# EAGLE design MDeckBA (EAGLE 9.0.1)

## Sheet 1 of 2
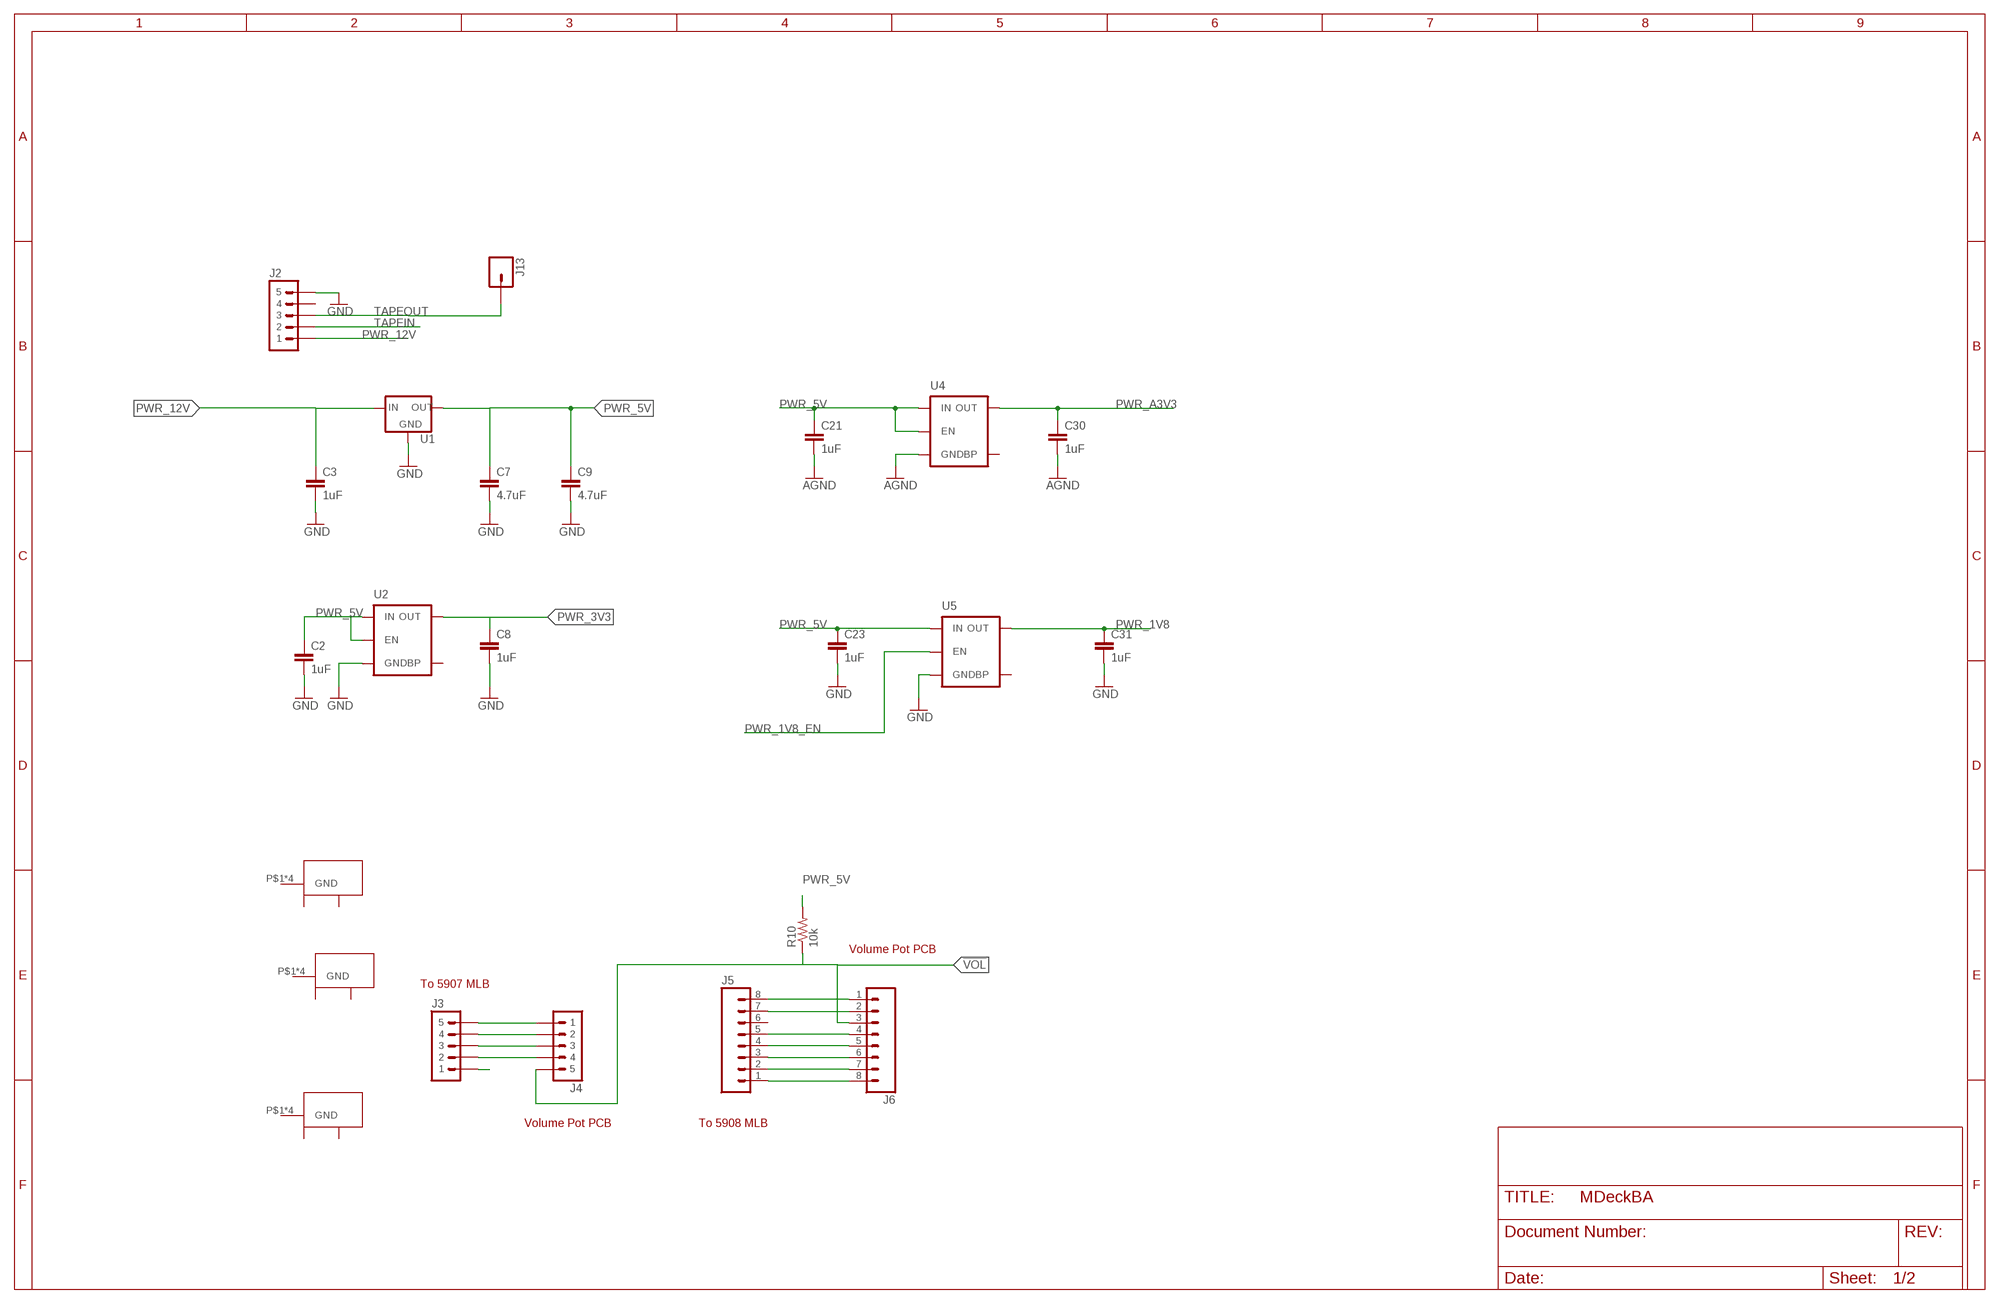
[diagram p0: schematic, sheet 1, part 1 of 3]
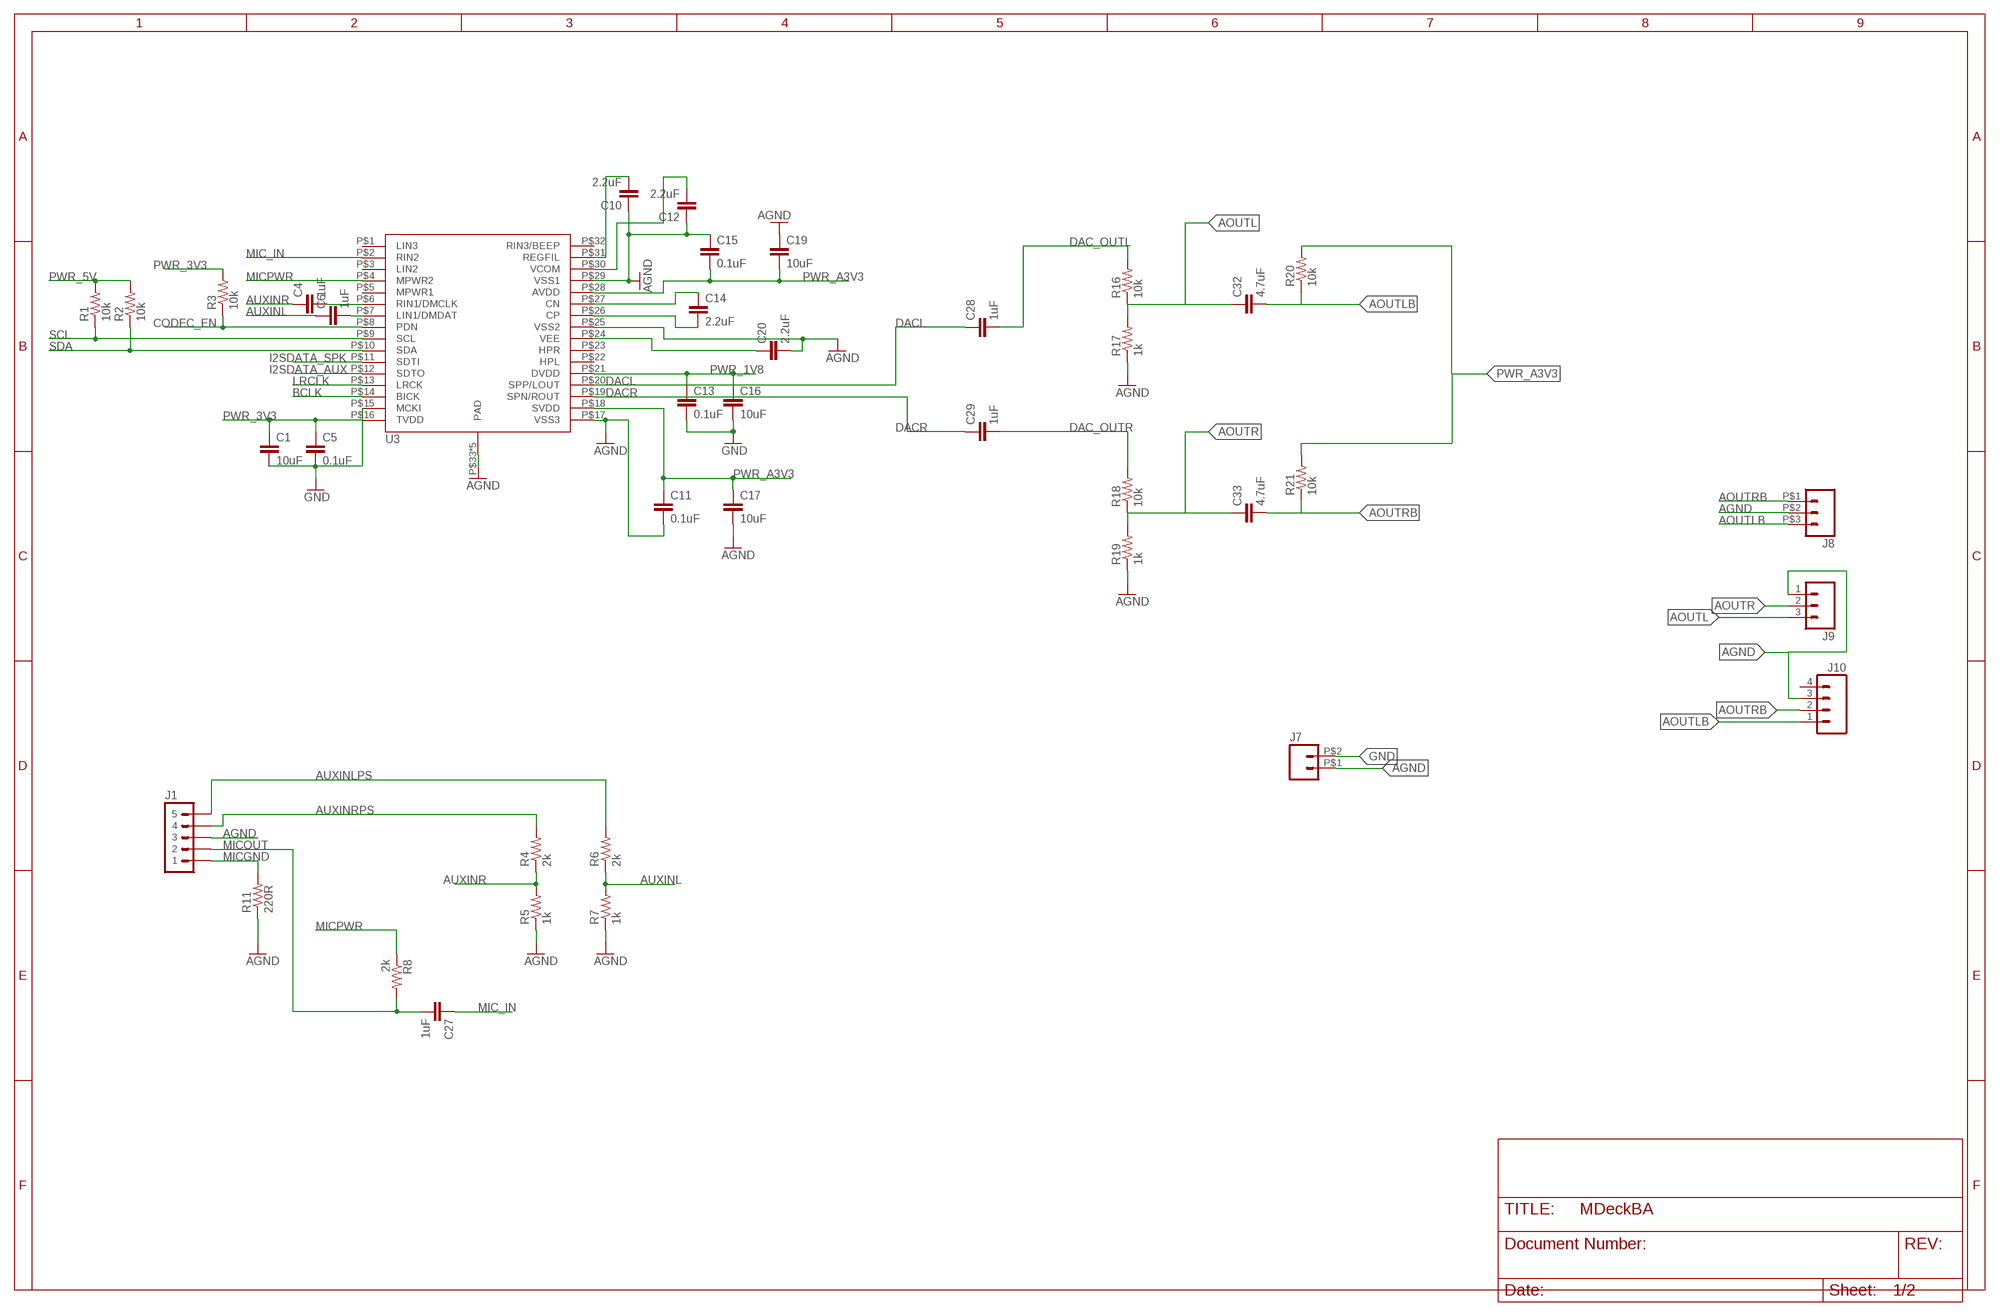
[diagram p1: schematic, sheet 1, part 2 of 3]
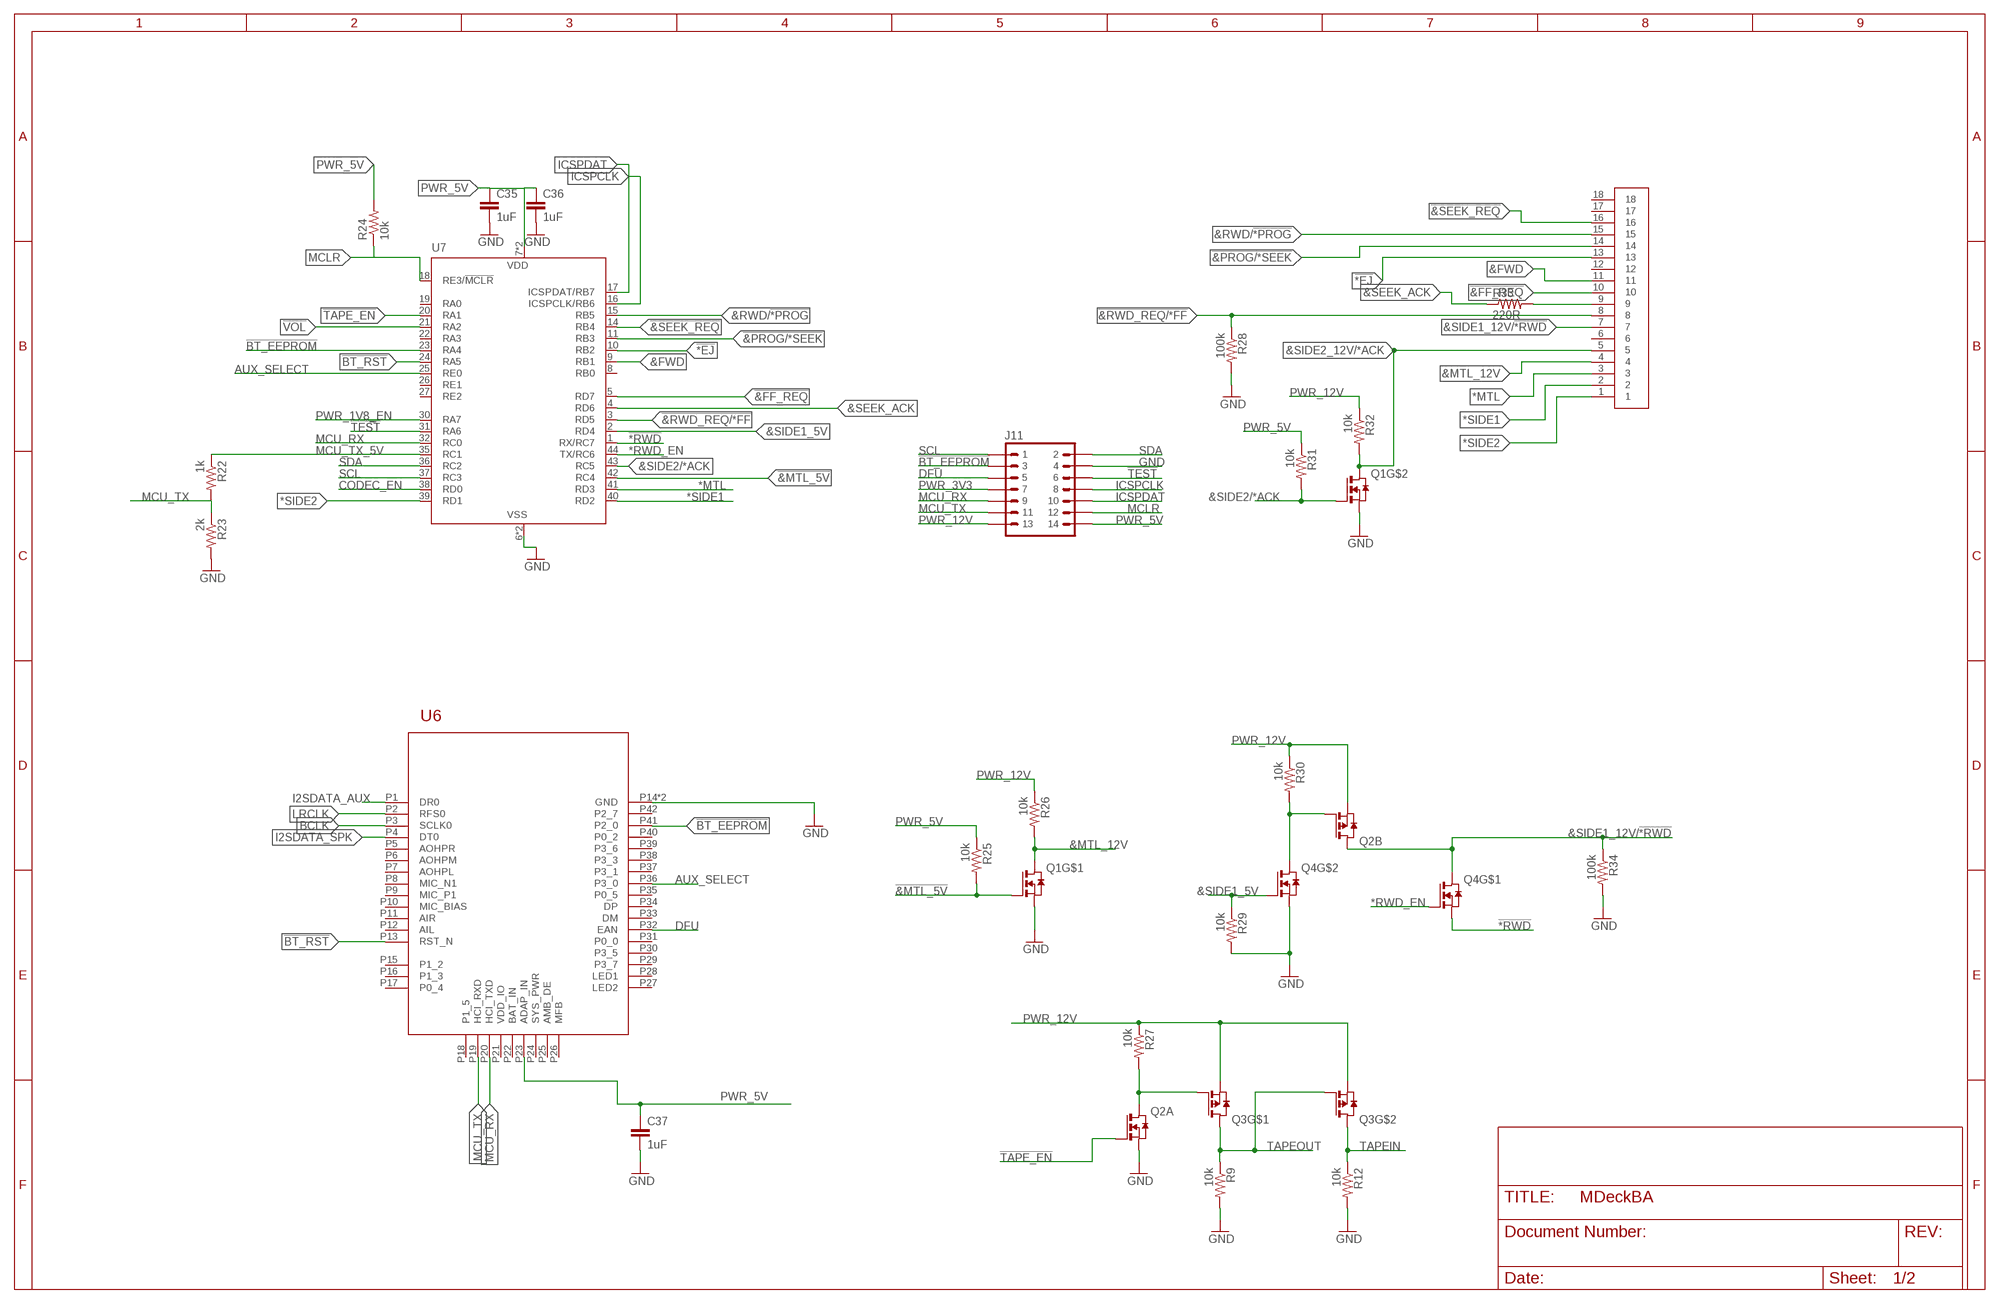
[diagram p2: schematic, sheet 1, part 3 of 3]

### Parts
C1  10uF  CAP0805  [0805]
C2  1uF  CAP0805  [0805]
C3  1uF  CAP0805  [0805]
C4  1uF  CAP0805  [0805]
C5  0.1uF  CAP0805  [0805]
C6  1uF  CAP0805  [0805]
C7  4.7uF  CAP0805  [0805]
C8  1uF  CAP0805  [0805]
C9  4.7uF  CAP0805  [0805]
C10  2.2uF  CAP0805  [0805]
C11  0.1uF  CAP0805  [0805]
C12  2.2uF  CAP0805  [0805]
C13  0.1uF  CAP0805  [0805]
C14  2.2uF  CAP0805  [0805]
C15  0.1uF  CAP0805  [0805]
C16  10uF  CAP0805  [0805]
C17  10uF  CAP0805  [0805]
C19  10uF  CAP0805  [0805]
C20  2.2uF  CAP0805  [0805]
C21  1uF  CAP0805  [0805]
C23  1uF  CAP0805  [0805]
C27  1uF  CAP0805  [0805]
C28  1uF  CAP0805  [0805]
C29  1uF  CAP0805  [0805]
C30  1uF  CAP0805  [0805]
C31  1uF  CAP0805  [0805]
C32  4.7uF  CAP0805  [0805]
C33  4.7uF  CAP0805  [0805]
C35  1uF  CAP0805  [0805]
C36  1uF  CAP0805  [0805]
C37  1uF  CAP0805  [0805]
J1  M05JST  [JST-5-PTH]
J2  M05JST-VERT  [JST-5-PTH-VERT]
J3  M05JST  [JST-5-PTH]
J4  M05JST-VERT  [JST-5-PTH-VERT]
J5  JST-PH-8  [JST-8-PTH]
J6  JST-PH-8-VERT  [JST-8-PTH-VERT]
J7  M022MM_PADS  [1X02_2MM_PADS]
J8  M032MM_PADS  [1X03_2MM_PADS]
J9  M03JST-PTH-VERT  [JST-3-PTH-VERT]
J10  M04JST-PTH-VERT  [JST-4-PTH-VERT]
J11  M07X2  [2X07_PADS_2MM]
J12  MOLEX_0039532184_18_POS_FFC  [MOLEX_0039532184_18_POS_FFC]
J13  M01PTH_NO_SILK_YES_STOP  [1X01_NO_SILK]
M1  KEYSTONE_7773_SCREW_TERMINAL  [KEYSTONE_7773_SCREW_TERMINAL]
M2  KEYSTONE_7773_SCREW_TERMINAL  [KEYSTONE_7773_SCREW_TERMINAL]
M3  KEYSTONE_7773_SCREW_TERMINAL  [KEYSTONE_7773_SCREW_TERMINAL]
Q1  N_MOSFETSOT-363  [SOT363]
Q2  PN_MOSFET-FDG6332C_F085SOT363  [SOT363]
Q3  P_MOSFET_DUAL  [SO08]
Q4  N_MOSFETSOT-363  [SOT363]
R1  10k  RESISTOR0805-RES  [0805]
R2  10k  RESISTOR0805-RES  [0805]
R3  10k  RESISTOR0805-RES  [0805]
R4  2k  RESISTOR0805-RES  [0805]
R5  1k  RESISTOR0805-RES  [0805]
R6  2k  RESISTOR0805-RES  [0805]
R7  1k  RESISTOR0805-RES  [0805]
R8  2k  RESISTOR0805-RES  [0805]
R9  10k  RESISTOR0805-RES  [0805]
R10  10k  RESISTOR0805-RES  [0805]
R11  220R  RESISTOR2010  [2010-RES]
R12  10k  RESISTOR0805-RES  [0805]
R16  10k  RESISTOR0805-RES  [0805]
R17  1k  RESISTOR0805-RES  [0805]
R18  10k  RESISTOR0805-RES  [0805]
R19  1k  RESISTOR0805-RES  [0805]
R20  10k  RESISTOR0805-RES  [0805]
R21  10k  RESISTOR0805-RES  [0805]
R22  1k  RESISTOR0805-RES  [0805]
R23  2k  RESISTOR0805-RES  [0805]
R24  10k  RESISTOR0805-RES  [0805]
R25  10k  RESISTOR0805-RES  [0805]
R26  10k  RESISTOR0805-RES  [0805]
R27  10k  RESISTOR0805-RES  [0805]
R28  100k  RESISTOR0805-RES  [0805]
R29  10k  RESISTOR0805-RES  [0805]
R30  10k  RESISTOR0805-RES  [0805]
R31  10k  RESISTOR0805-RES  [0805]
R32  10k  RESISTOR0805-RES  [0805]
R33  220R  RESISTOR0805-RES  [0805]
R34  100k  RESISTOR0805-RES  [0805]
U1  V_REG_SOT223LDL1117  [SOT223]
U2  V_REG_LDOMIC5317SMD  [SOT23-5]
U3  AK4951  [QFN32_0.4MM]
U4  V_REG_LDOLDLN025SMD  [SOT23-5]
U5  V_REG_LDOMIC5317-1.8SMD  [SOT23-5]
U6  BM64SMD  [BM64]
U7  PIC16LF18875PIC16LF18877  [TQFP44]

### Nets
!&FF_REQ: J12.10 U7.5(RD7)
!&MTL_5V: Q1.2(G) R25.2 U7.42(RC4)
!&PROG/*SEEK: J12.14 U7.11(RB3)
!&RWD_REQ/*FF: J12.8 R28.1 U7.3(RD5)
!&SEEK_REQ: J12.16 U7.14(RB4)
!*EJ: J12.13 U7.10(RB2)
!*RWD: Q4.1(S) U7.1(RX/RC7)
!BT_EEPROM: J11.P$3 U6.P41(P2_0) U7.23(RA4)
!BT_RST: U6.P13(RST_N) U7.24(RA5)
!TAPE_EN: Q2.2(A:G) U7.20(RA1)
!TEST: J11.P$6 U7.31(RA6)
!VOL: J4.5 J6.3 R10.1 U7.21(RA2)
&FWD: J12.11 U7.9(RB1)
&MTL_12V: J12.4 Q1.6(D) R26.2
&RWD/!*PROG: J12.15 U7.15(RB5)
&SEEK_ACK: R33.1 U7.4(RD6)
&SIDE1_5V: Q4.5(G) R29.1 U7.2(RD4)
&SIDE1_12V/!*RWD: J12.7 Q2.3(B:D) Q4.6(D) R34.1
&SIDE2/*ACK: Q1.5(G) R31.2 U7.43(RC5)
&SIDE2_12V/*ACK: J12.5 Q1.3(D) R32.2
*MTL: J12.3 U7.41(RD3)
*RWD_EN: Q4.2(G) U7.44(TX/RC6)
*SIDE1: J12.2 U7.40(RD2)
*SIDE2: J12.1 U7.39(RD1)
AGND: C10.1 C11.2 C12.1 C15.1 C17.2 C19.1 C20.2 C21.2 C30.2 J1.3 J7.P$1 J8.P$2 J9.1 J10.3 R5.1 R7.1 R11.1 R17.1 R19.1 U3.P$17(VSS3) U3.P$25(VSS2) U3.P$29(VSS1) U3.P$33(PAD) U3.P$34(PAD) U3.P$35(PAD) U3.P$36(PAD) U3.P$37(PAD) U4.2(GND)
AOUTL: C32.1 J9.3 R16.1 R17.2
AOUTLB: C32.2 J8.P$3 J10.1 R20.1
AOUTR: C33.1 J9.2 R18.1 R19.2
AOUTRB: C33.2 J8.P$1 J10.2 R21.1
AUX_SELECT: U6.P36(P3_0) U7.25(RE0)
AUXINL: C6.1 R6.1 R7.2
AUXINLPS: J1.5 R6.2
AUXINR: C4.1 R4.1 R5.2
AUXINRPS: J1.4 R4.2
BCLK: U3.P$14(BICK) U6.P3(SCLK0)
CODEC_EN: R3.1 U3.P$8(PDN) U7.38(RD0)
DAC_OUTL: C28.2 R16.2
DAC_OUTR: C29.2 R18.2
DACL: C28.1 U3.P$20(SPP/LOUT)
DACR: C29.1 U3.P$19(SPN/ROUT)
DFU: J11.P$5 U6.P32(EAN)
GND: C1.2 C2.2 C3.2 C5.2 C7.2 C8.2 C9.2 C13.2 C16.2 C23.2 C31.2 C35.2 C36.2 C37.2 J2.5 J7.P$2 J11.P$4 Q1.1(S) Q1.4(S) Q2.1(A:S) Q4.4(S) R9.2 R12.2 R23.2 R28.2 R29.2 R34.2 U1.1(GND) U2.2(GND) U3.P$15(MCKI) U5.2(GND) U6.P14(GND) U6.P43(GND) U7.6(VSS) U7.29(VSS)
I2SDATA_AUX: U3.P$12(SDTO) U6.P1(DR0)
I2SDATA_SPK: U3.P$11(SDTI) U6.P4(DT0)
ICSPCLK: J11.P$8 U7.16(ICSPCLK/RB6)
ICSPDAT: J11.P$10 U7.17(ICSPDAT/RB7)
LRCLK: U3.P$13(LRCK) U6.P2(RFS0)
MCLR: J11.P$12 R24.1 U7.18(RE3/!MCLR)
MCU_RX: J11.P$9 U6.P20(HCI_TXD) U7.32(RC0)
MCU_TX: J11.P$11 R22.2 R23.1 U6.P19(HCI_RXD)
MCU_TX_5V: R22.1 U7.35(RC1)
MIC_IN: C27.1 U3.P$2(RIN2)
MICGND: J1.1 R11.2
MICOUT: C27.2 J1.2 R8.2
MICPWR: R8.1 U3.P$4(MPWR2)
N$1: J12.9 R33.2
N$2: Q2.5(B:G) Q4.3(D) R30.2
N$3: J3.1
N$12: C14.2 U3.P$26(CP)
N$14: C10.2 U3.P$31(REGFIL)
N$15: C20.1 U3.P$24(VEE)
N$16: J5.8 J6.1
N$17: C12.2 U3.P$30(VCOM)
N$18: C14.1 U3.P$27(CN)
N$19: C6.2 U3.P$7(LIN1/DMDAT)
N$20: J5.7 J6.2
N$21: J5.5 J6.4
N$22: J5.4 J6.5
N$23: J5.3 J6.6
N$24: J5.2 J6.7
N$25: J5.1 J6.8
N$26: C4.2 U3.P$6(RIN1/DMCLK)
N$32: J3.5 J4.1
N$33: J3.4 J4.2
N$49: J3.3 J4.3
N$50: J3.2 J4.4
PWR_1V8: C13.1 C16.1 C31.1 U3.P$21(DVDD) U5.5(OUT)
PWR_1V8_EN: U5.3(EN) U7.30(RA7)
PWR_3V3: C1.1 C5.1 C8.1 J11.P$7 R3.2 U2.5(OUT) U3.P$16(TVDD)
PWR_5V: C2.1 C7.1 C9.1 C21.1 C23.1 C35.1 C36.1 C37.1 J11.P$14 R1.2 R2.2 R10.2 R24.2 R25.1 R31.1 U1.2(OUT) U1.4(OUT) U2.1(IN) U2.3(EN) U4.1(IN) U4.3(EN) U5.1(IN) U6.P23(ADAP_IN) U7.7(VDD) U7.28(VDD)
PWR_12V: C3.1 J2.1 J11.P$13 Q2.4(B:S) Q3.1(S) Q3.3(S) R26.1 R27.1 R30.1 R32.1 U1.3(IN)
PWR_A3V3: C11.1 C15.2 C17.1 C19.2 C30.1 R20.2 R21.2 U3.P$18(SVDD) U3.P$28(AVDD) U4.5(OUT)
SCL: J11.P$1 R1.1 U3.P$9(SCL) U7.37(RC3)
SDA: J11.P$2 R2.1 U3.P$10(SDA) U7.36(RC2)
TAPEIN: J2.2 Q3.5(D) Q3.6(D) R12.1
TAPEINSIG: Q2.6(A:D) Q3.2(G) R27.2
TAPEOUT: J2.3 J13.1 Q3.4(G) Q3.7(D) Q3.8(D) R9.1
Unconnected: J2.4 J5.6 J10.4 J12.6 J12.12 J12.17 J12.18 M1.P$1(GND) M1.P$2(GND) M1.P$3(GND) M1.P$4(GND) M2.P$1(GND) M2.P$2(GND) M2.P$3(GND) M2.P$4(GND) M3.P$1(GND) M3.P$2(GND) M3.P$3(GND) M3.P$4(GND) U2.4(BP) U3.P$1(LIN3) U3.P$3(LIN2) U3.P$5(MPWR1) U3.P$22(HPL) U3.P$23(HPR) U3.P$32(RIN3/BEEP) U4.4(BP) U5.4(BP) U6.P5(AOHPR) U6.P6(AOHPM) U6.P7(AOHPL) U6.P8(MIC_N1) U6.P9(MIC_P1) U6.P10(MIC_BIAS) U6.P11(AIR) U6.P12(AIL) U6.P15(P1_2) U6.P16(P1_3) U6.P17(P0_4) U6.P18(P1_5) U6.P21(VDD_IO) U6.P22(BAT_IN) U6.P24(SYS_PWR) U6.P25(AMB_DE) U6.P26(MFB) U6.P27(LED2) U6.P28(LED1) U6.P29(P3_7) U6.P30(P3_5) U6.P31(P0_0) U6.P33(DM) U6.P34(DP) U6.P35(P0_5) U6.P37(P3_1) U6.P38(P3_3) U6.P39(P3_6) U6.P40(P0_2) U6.P42(P2_7) U7.8(RB0) U7.19(RA0) U7.22(RA3) U7.26(RE1) U7.27(RE2)

### Notes on the sheet
- Volume Pot PCB
- To 5907 MLB
- Volume Pot PCB | To 5908 MLB

## Sheet 2 of 2

## Library data of the parts
C1-C17 C19-C21 C23 C27-C33 C35-C37 = spareparts:CAP: Capacitor Standard 0603 ceramic capacitor, and 0.1" leaded capacitor.; TYPE: SMD
J1 J3 = spareparts:M05: Header 5 Standard 5-pin 0.1" header. Use with straight break away headers (SKU : PRT-00116), right angle break away headers (PRT-00553), swiss pins (PRT-00743), machine pins (PRT-00117), and female headers (PRT-00115). Molex polarized connector foot print use with SKU : PRT-08230 with associated crimp pins and housings.; DIGI_PN: 455-1722-ND; MFN: JST Sales America Inc.; MFP: S5B-PH-K-S(LF)(SN); TYPE: TH
J2 J4 = spareparts:M05: Header 5 Standard 5-pin 0.1" header. Use with straight break away headers (SKU : PRT-00116), right angle break away headers (PRT-00553), swiss pins (PRT-00743), machine pins (PRT-00117), and female headers (PRT-00115). Molex polarized connector foot print use with SKU : PRT-08230 with associated crimp pins and housings.; DIGI_PN: 455-1707-ND; MFN: JST Sales America Inc.; MFP: B5B-PH-K-S(LF)(SN); TYPE: TH
J5 = spareparts:JST-PH-8: JST PH Series 2.0mm 8 pin right angle through hole connector; DIGI_PN: 455-1725-ND; MFN: JST Sales America Inc.; MFP: S8B-PH-K-S(LF)(SN); TYPE: TH
J6 = spareparts:JST-PH-8-VERT: JST PH Series 2.0mm 8 pin vertical through hole connector; DIGI_PN: 455-1710-ND; MFN: JST Sales America Inc.; MFP: B8B-PH-K-S(LF)(SN); TYPE: TH
J7 = spareparts:M02: Standard 2-pin 0.1" header. Use with - straight break away headers ( PRT-00116) - right angle break away headers (PRT-00553) - swiss pins (PRT-00743) - machine pins (PRT-00117) - female headers (PRT-00115) Molex polarized connector foot print use with: PRT-08233 with associated crimp pins and housings. 2.54_SCREWTERM for use with PRT-10571. 3.5mm Screw Terminal footprints for PRT-08084 5mm Screw Terminal footprints for use with PRT-08432
J8 = spareparts:M03: Header 3 Standard 3-pin 0.1" header. Use with straight break away headers (SKU : PRT-00116), right angle break away headers (PRT-00553), swiss pins (PRT-00743), machine pins (PRT-00117), and female headers (PRT-00115). Molex polarized connector foot print use with SKU : PRT-08232 with associated crimp pins and housings.
J9 = spareparts:M03: Header 3 Standard 3-pin 0.1" header. Use with straight break away headers (SKU : PRT-00116), right angle break away headers (PRT-00553), swiss pins (PRT-00743), machine pins (PRT-00117), and female headers (PRT-00115). Molex polarized connector foot print use with SKU : PRT-08232 with associated crimp pins and housings.; DIGI_PN: 455-1705-ND; MFN: JST Sales America Inc.; MFP: B3B-PH-K-S(LF)(SN); TYPE: TH
J10 = spareparts:M04: Header 4 Standard 4-pin 0.1" header. Use with straight break away headers (SKU : PRT-00116), right angle break away headers (PRT-00553), swiss pins (PRT-00743), machine pins (PRT-00117), and female headers (PRT-00115). Molex polarized connector foot print use with SKU : PRT-08231 with associated crimp pins and housings. 1MM SMD Version SKU: PRT-10208; DIGI_PN: 455-1706-ND; MFN: JST Sales America Inc.; MFP: B4B-PH-K-S(LF)(SN); TYPE: TH
J11 = spareparts:M07X2: 14 pin 2 row 2mm pitch JST PUD series connector
J12 = spareparts:MOLEX_0039532184_18_POS_FFC: Molex 1.25 mm pitch 18 position flat flex connector; DIGI_PN: WM12723-ND; MFN: Molex LLC; MFP: 0039532184; TYPE: TH
J13 = SparkFun-Connectors:M01: Header 1 Standard 1-pin 0.1" header. Use with straight break away headers (SKU : PRT-00116), right angle break away headers (PRT-00553), swiss pins (PRT-00743), machine pins (PRT-00117), and female headers (PRT-00115). SMTSO-256-ET is a "flush mount" nut for a 4-40 screw. The older package used to be too tight, and did not allow it to sit properly thru the drill hit. The latest (0.165DIA) fits nice and snug.
M1-M3 = spareparts:KEYSTONE_7773_SCREW_TERMINAL: Keystone 7773 Right angle 4-40 screw terminal; DIGI_PN: 36-7773-ND; MFN: Keystone Electronics; MFP: 7773; TYPE: TH
Q1 Q4 = spareparts:N_MOSFET: Dual N-channel enhancement MOSFET; DIGI_PN: SSM6N7002KFULFCT-ND; MFN: Toshiba Semiconductor and Storage; MFP: SSM6N7002KFU,LF
Q2 = spareparts:PN_MOSFET-: DUAL N AND P-CHANNEL ENHANCEMENT MODE MOSFET source ZXMD63C02.pdf from http://www.zetex.com/; DIGI_PN: FDG6332C-F085FSCT-ND; MFN: ON Semiconductor; MFP: FDG6332C-F085; TYPE: SMD
Q3 = spareparts:P_MOSFET_DUAL: Dual P-channel MOSFET; DIGI_PN: DMP3085LSD-13DICT-ND; MFN: Diodes Incorporated; MFP: DMP3085LSD-13; TYPE: SMD
R1-R12 R16-R34 = spareparts:RESISTOR: Resistor Basic schematic elements and footprints for 0603, 1206, and PTH resistors.; TYPE: SMD
U1 = spareparts:V_REG_SOT223: On Semiconductor !A Fixed DC Voltage Regulator NCP1117LP; DIGI_PN: 497-17240-1-ND; MFN: STMicroelectronics; MFP: LDL1117S50R; TYPE: SMD
U2 = spareparts:V_REG_LDO: Voltage Regulator LDO Standard 150mA LDO voltage regulator in SOT-23 layout. Micrel part MIC5205. BP (by-pass) pin is used to lower output noise with 470pF cap.; DESCRIPTION: Inexpensive 3.3V regulator 150mA output 6V input; DIGI_PN: MIC5317-3.3YM5-CT-ND; MFN: Microchip Technology; MFP: MIC5317-3.3YM5-TR; TYPE: SMD; VOLTAGE: 3.3
U3 = spareparts:AK4951: Asahi KASEI AK4951 Stereo Audio CODEC; DIGI_PN: 974-1064-1-ND; MFN: AKM Semiconductor Inc.; MFP: AK4951EN; TYPE: SMD
U4 = spareparts:V_REG_LDO: Voltage Regulator LDO Standard 150mA LDO voltage regulator in SOT-23 layout. Micrel part MIC5205. BP (by-pass) pin is used to lower output noise with 470pF cap.; DESCRIPTION: Low-noise 3.3V fixed regulator 5V input; DIGI_PN: 497-17777-1-ND; MFN: STMicroelectronics; MFP: LDLN025M33R; TYPE: SMD; VOLTAGE: 3.3
U5 = spareparts:V_REG_LDO: Voltage Regulator LDO Standard 150mA LDO voltage regulator in SOT-23 layout. Micrel part MIC5205. BP (by-pass) pin is used to lower output noise with 470pF cap.; DESCRIPTION: 1.8V inexpensive 150mA; DIGI_PN: MIC5317-1.8YM5-CT-ND; MFN: Microchip Technology; MFP: MIC5317-1.8YM5-TR; TYPE: SMD; VOLTAGE: 1.8
U6 = spareparts:BM64: Microchip BM64 Bluetooth Audio Module; DIGI_PN: BM64SPKS1MC2-0001AA-ND; MFN: Microchip Technology; MFP: BM64SPKS1MC2-0001AA; TYPE: SMD
U7 = spareparts:PIC16LF18875: Microchip PIC PIC16LF18875 8 bit microcontroller; DIGI_PN: PIC16F18877-I/PT-ND; MFN: Microchip Technology; MFP: PIC16F18877-I/PT; TYPE: SMD

## Board
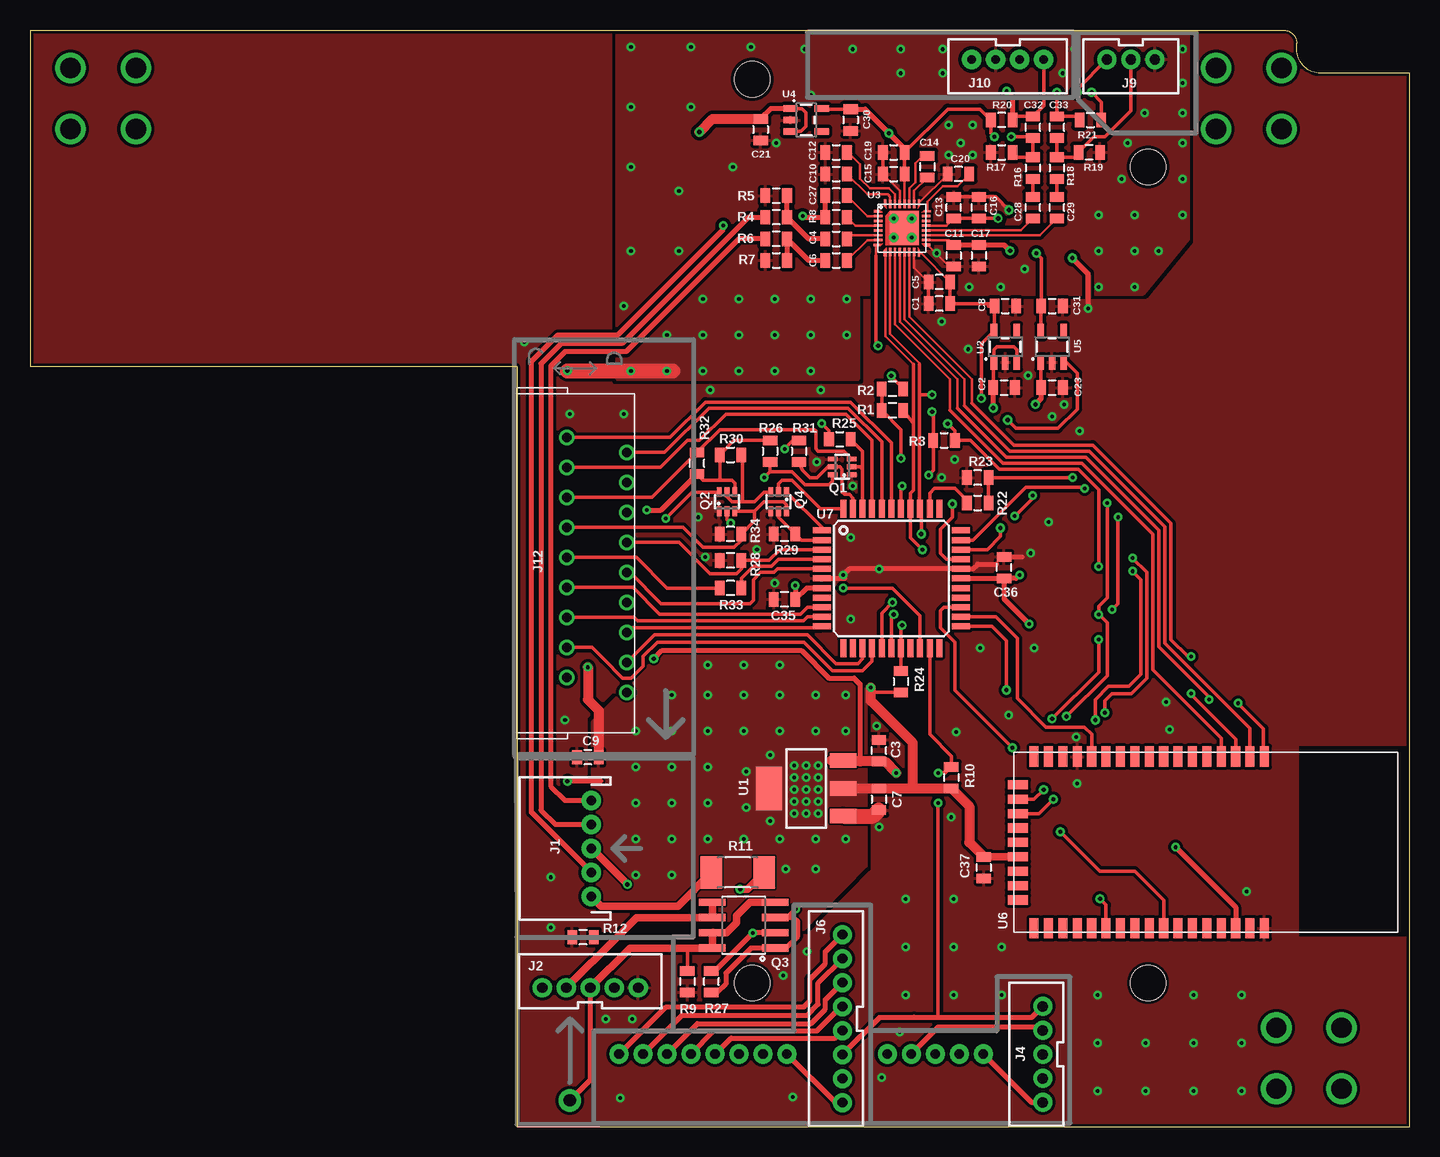
[diagram p3: board, top side]
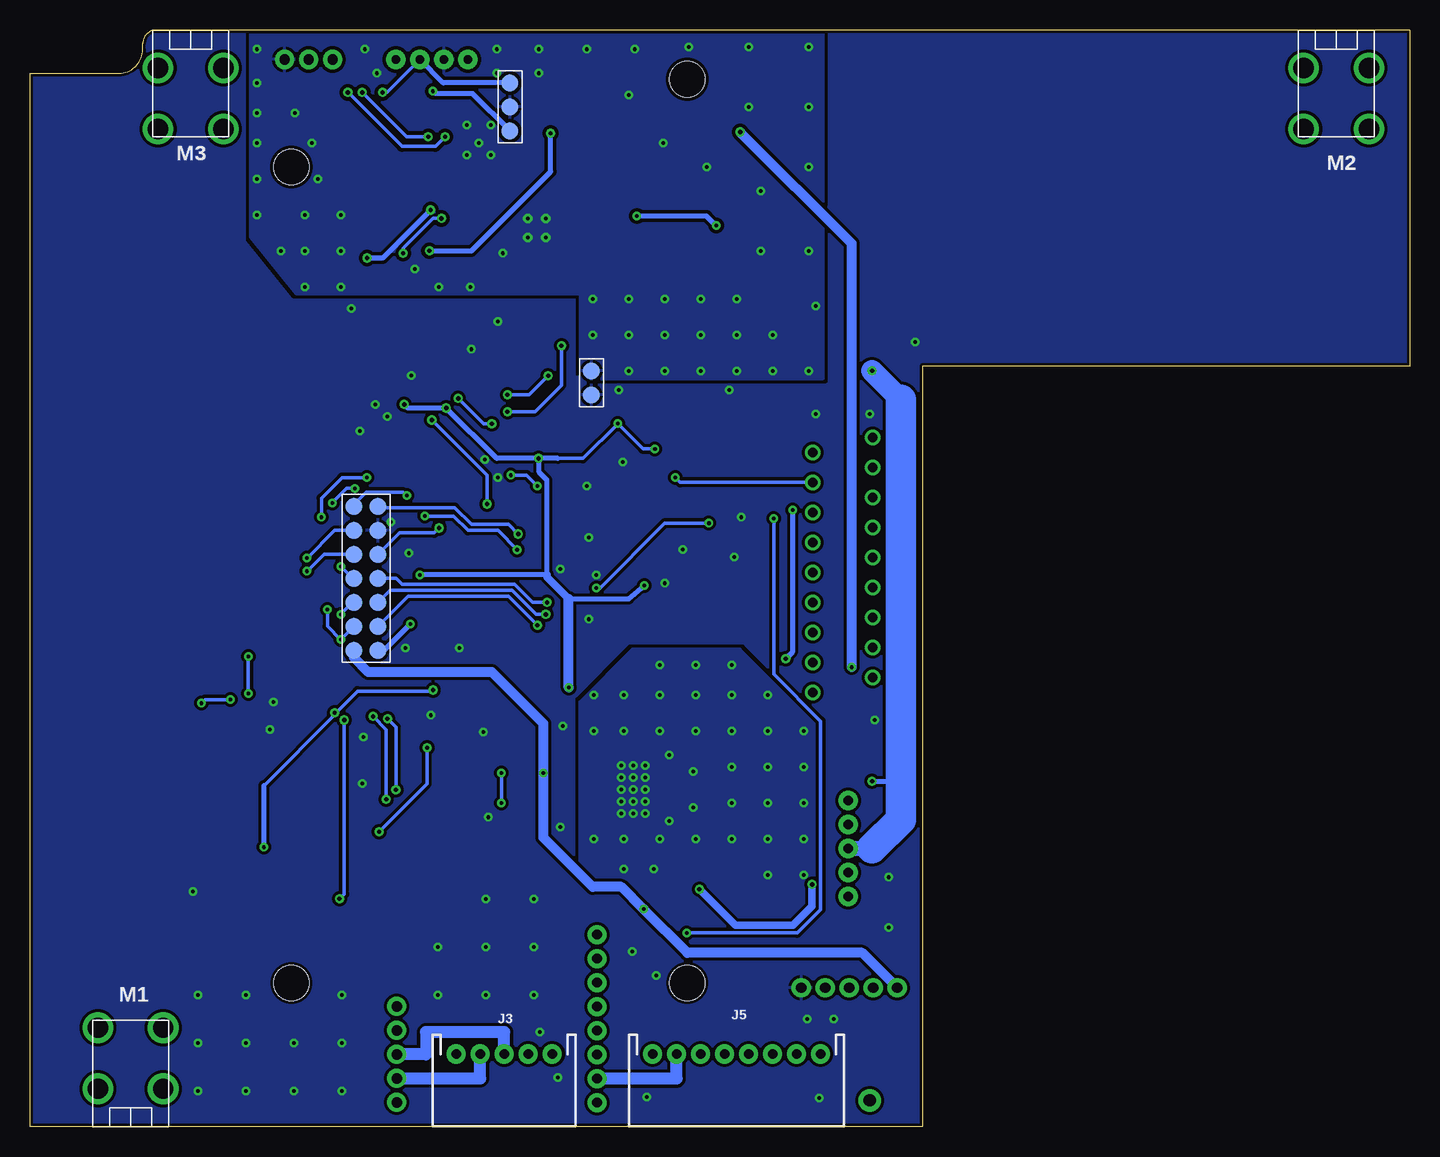
[diagram p4: board, bottom side, seen from below]

Size 115 x 91.4 mm. Coordinates in mm from the lower left corner, seen from the top.
Outline: 0,91.4 104.48,91.4 arc-90 105.6,90.28 105.6,89.78 arc90 107.58,87.8 115,87.8 115,0 40.6,0 40.6,63.4 0,63.4 0,91.4
Copper layers (1*16): Top 0.035mm / dielectric 1.5mm / Bottom 0.035mm
Design rules "default *": minimum track width 6mil, minimum drill 0.3mm, track to track 6mil, track to pad 6mil, pad to pad 6mil, via to via 6mil, smd to smd 5mil, copper to edge 10mil, drill to drill 8mil, minimum pad ring 10mil, minimum via ring 8mil, stop-mask expansion 4mil, vias tented up to drill 17mil, thermal gap 10mil
Holes 2.95 mm at 60.2,12 93.2,12 60.2,87.3 93.2,80

### Footprints (pad centres in the part's own frame; a part is rotated, then mirrored left to right if it is on the bottom)
0805 = smd 0.8 x 1.2: 1 -0.9,0; 2 0.9,0
JST-5-PTH = drill 0.8 pad 1.6: 1 -4,0; 2 -2,0; 3 0,0; 4 2,0; 5 4,0
JST-5-PTH-VERT = drill 0.866 pad 1.6: 1 -4,0.18; 2 -2,0.18; 3 0,0.18; 4 2,0.18; 5 4,0.18
JST-8-PTH = drill 0.8 pad 1.6: 1 -7,-2; 2 -5,-2; 3 -3,-2; 4 -1,-2; 5 1,-2; 6 3,-2; 7 5,-2; 8 7,-2
JST-8-PTH-VERT = drill 0.8 pad 1.6: 1 -3,-0.55; 2 -1,-0.55; 3 1,-0.55; 4 3,-0.55; 5 5,-0.55; 6 7,-0.55; 7 9,-0.55; 8 11,-0.55
1X02_2MM_PADS = smd 1.4 x 1.4: P$1 0,0; P$2 2,0
1X03_2MM_PADS = smd 1.4 x 1.4: P$1 0,0; P$2 2,0; P$3 4,0
JST-3-PTH-VERT = drill 0.866 pad 1.6: 1 -2,-0.55; 2 0,-0.55; 3 2,-0.55
JST-4-PTH-VERT = drill 0.7 pad 1.6: 1 -3,-0.55; 2 -1,-0.55; 3 1,-0.55; 4 3,-0.55
2X07_PADS_2MM = smd 1.4 x 1.4 bottom: P$1 12,0; P$2 12,2; P$3 10,0; P$4 10,2; P$5 8,0; P$6 8,2; P$7 6,0; P$8 6,2; P$9 4,0; P$10 4,2; P$11 2,0; P$12 2,2; P$13 0,0; P$14 0,2
MOLEX_0039532184_18_POS_FFC = drill 0.8: 1 3.65,4.15; 2 4.9,9.15; 3 6.15,4.15; 4 7.4,9.15; 5 8.65,4.15; 6 9.9,9.15; 7 11.15,4.15; 8 12.4,9.15; 9 13.65,4.15; 10 14.9,9.15; 11 16.15,4.15; 12 17.4,9.15; 13 18.65,4.15; 14 19.9,9.15; 15 21.15,4.15; 16 22.4,9.15; 17 23.65,4.15; 18 24.9,9.15
1X01_NO_SILK = drill 1.016 pad 1.88: 1 0,0
KEYSTONE_7773_SCREW_TERMINAL = drill 1.7: P$1 3.175,-2.718; P$2 8.255,-2.718; P$3 3.175,2.718; P$4 8.255,2.718
SOT363 = smd 0.4 x 0.8: 1 -0.65,-0.8; 2 0,-0.8; 3 0.65,-0.8; 4 0.65,0.8; 5 0,0.8; 6 -0.65,0.8
SO08 = smd 0.61 x 2.21: 1 -1.905,-2.616; 2 -0.635,-2.616; 3 0.635,-2.616; 4 1.905,-2.616; 5 1.905,2.616; 6 0.635,2.616; 7 -0.635,2.616; 8 -1.905,2.616
2010-RES = smd 1.8 x 2.7: 1 -2.2,0; 2 2.2,0
SOT223 = smd 1.219 x 2.235: 1 -2.311,-3.099; 2 0,-3.099; 3 2.311,-3.099 | smd 3.6 x 2.2: 4 0,3.099
SOT23-5 = smd 0.55 x 1.2: 1 -0.95,-1.3; 2 0,-1.3; 3 0.95,-1.3; 4 0.95,1.3; 5 -0.95,1.3
QFN32_0.4MM = smd 0.2 x 0.5: P$1 -1.4,-2.1; P$8 1.4,-2.1; P$17 1.4,2.1; P$24 -1.4,2.1 | smd 0.2 x 0.7: P$2 -1,-2; P$3 -0.6,-2; P$4 -0.2,-2; P$5 0.2,-2; P$6 0.6,-2; P$7 1,-2; P$18 1,2; P$19 0.6,2; P$20 0.2,2; P$21 -0.2,2; P$22 -0.6,2; P$23 -1,2 | smd 0.5 x 0.2: P$9 2.1,-1.4; P$16 2.1,1.4; P$25 -2.1,1.4; P$32 -2.1,-1.4 | smd 0.7 x 0.2: P$10 2,-1; P$11 2,-0.6; P$12 2,-0.2; P$13 2,0.2; P$14 2,0.6; P$15 2,1; P$26 -2,1; P$27 -2,0.6; P$28 -2,0.2; P$29 -2,-0.2; P$30 -2,-0.6; P$31 -2,-1 | smd 2.8 x 2.4: P$33 0,0.2 | drill 0.3: P$34 -0.8,0.8; P$35 0.8,0.8; P$36 -0.8,-0.7; P$37 0.8,-0.7
BM64 = smd 1.7 x 0.76: P1 0.35,20.9; P2 0.35,19.7; P3 0.35,18.5; P4 0.35,17.3; P5 0.35,16.1; P6 0.35,14.9; P7 0.35,13.7; P8 0.35,12.5; P9 0.35,11.3; P10 0.35,10.1; P11 0.35,8.9; P12 0.35,7.7; P13 0.35,6.5; P14 0.35,5.3; P15 0.35,4.1; P16 0.35,2.9; P17 0.35,1.7; P27 14.65,1.7; P28 14.65,2.9; P29 14.65,4.1; P30 14.65,5.3; P31 14.65,6.5; P32 14.65,7.7; P33 14.65,8.9; P34 14.65,10.1; P35 14.65,11.3; P36 14.65,12.5; P37 14.65,13.7; P38 14.65,14.9; P39 14.65,16.1; P40 14.65,17.3; P41 14.65,18.5; P42 14.65,19.7; P43 14.65,20.9 | smd 0.76 x 1.7: P18 2.7,0.35; P19 3.9,0.35; P20 5.1,0.35; P21 6.3,0.35; P22 7.5,0.35; P23 8.7,0.35; P24 9.9,0.35; P25 11.1,0.35; P26 12.3,0.35
TQFP44 = smd 1.5 x 0.5: 1 -5.8,4; 2 -5.8,3.2; 3 -5.8,2.4; 4 -5.8,1.6; 5 -5.8,0.8; 6 -5.8,0; 7 -5.8,-0.8; 8 -5.8,-1.6; 9 -5.8,-2.4; 10 -5.8,-3.2; 11 -5.8,-4; 23 5.8,-4; 24 5.8,-3.2; 25 5.8,-2.4; 26 5.8,-1.6; 27 5.8,-0.8; 28 5.8,0; 29 5.8,0.8; 30 5.8,1.6; 31 5.8,2.4; 32 5.8,3.2; 33 5.8,4 | smd 0.5 x 1.5: 12 -4,-5.8; 13 -3.2,-5.8; 14 -2.4,-5.8; 15 -1.6,-5.8; 16 -0.8,-5.8; 17 0,-5.8; 18 0.8,-5.8; 19 1.6,-5.8; 20 2.4,-5.8; 21 3.2,-5.8; 22 4,-5.8; 34 4,5.8; 35 3.2,5.8; 36 2.4,5.8; 37 1.6,5.8; 38 0.8,5.8; 39 0,5.8; 40 -0.8,5.8; 41 -1.6,5.8; 42 -2.4,5.8; 43 -3.2,5.8; 44 -4,5.8

### Placement (x,y rotation side)
C1  75.8,68.6 180 top
C2  81.2,61.6 0 top
C3  70.77,31.35 90 top
C4  67.2,74 0 top
C5  75.8,70.4 180 top
C6  67.2,72.2 0 top
C7  70.77,27.3 270 top
C8  81.3,68.4 0 top
C9  46.5,30.8 180 top
C10  67.2,79.4 0 top
C11  77,72.6 270 top
C12  67.2,81.2 0 top
C13  77,76.6 90 top
C14  74.8,80 270 top
C15  72,79.4 0 top
C16  79.1,76.6 90 top
C17  79.1,72.6 270 top
C19  72,81.2 0 top
C20  77.4,79.4 180 top
C21  60.9,83.1 270 top
C23  85.2,61.6 0 top
C27  67.2,77.6 180 top
C28  83.6,76.6 90 top
C29  85.6,76.6 90 top
C30  68.4,83.9 270 top
C31  85.2,68.4 0 top
C32  83.6,83.3 90 top
C33  85.6,83.3 90 top
C35  62.9,43.95 180 top
C36  81.2,46.6 90 top
C37  79.5,21.6 270 top
J1  46.8,23.2 90 top
J2  46.7,11.41 0 top
J3  75.47,6.06 180 bottom
J4  84.61,6.04 90 top
J5  56.1,4.06 180 bottom
J6  67.18,5.01 90 top
J7  68.2,63 270 bottom
J8  75,87 270 bottom
J9  91.77,88.4 180 top
J10  81.5,88.4 180 top
J11  88,39.7 90 top
J12  40.6,61.1 270 top
J13  45,2.2 0 top
M1  106.61,0 90 bottom
M2  6.1,91.4 270 bottom
M3  101.6,91.4 270 bottom
Q1  67.7,55 90 top
Q2  58.1,52.1 0 top
Q3  59.5,16.8 90 top
Q4  62.4,52.1 180 top
R1  71.9,59.7 180 top
R2  71.9,61.5 180 top
R3  76.2,57.2 0 top
R4  62.2,75.8 180 top
R5  62.2,77.6 0 top
R6  62.2,74 180 top
R7  62.2,72.2 0 top
R8  67.2,75.8 180 top
R9  54.8,12.1 270 top
R10  76.8,29.1 270 top
R11  59,21.2 180 top
R12  46.1,15.8 180 top
R16  83.6,79.9 270 top
R17  81,81.2 0 top
R18  85.6,79.9 270 top
R19  88.3,81.2 180 top
R20  81,83.9 180 top
R21  88.4,83.9 0 top
R22  79,52 0 top
R23  79,54.1 180 top
R24  72.6,37.1 270 top
R25  67.5,57.3 0 top
R26  61.7,56.3 270 top
R27  56.8,12.1 90 top
R28  58.4,47.2 180 top
R29  62.9,49.4 180 top
R30  58.4,56 0 top
R31  64.1,56.3 270 top
R32  55.6,55.3 90 top
R33  58.4,44.9 180 top
R34  58.4,49.4 180 top
U1  64.7,28.2 90 top
U2  81.3,65 0 top
U3  72.7,74.9 270 top
U4  64.7,83.9 270 top
U5  85.2,65 0 top
U6  82,31.2 270 top
U7  71.8,45.7 0 top

### Tracks (layer width: path | path; a pad name or v marks a point on that pad's centre or on a via)
!&FF_REQ
  Top 0.305: J12.10 50,46.2 52.6,43.6 60,43.6 60.3,43.9 60.3,45.6 60.9,46.2 62,46.2 62.3,46.5 U7.5
!&MTL_5V
  Top 0.305: Q1.2 69.2,55 69.4,54.8 | 69.4,54.8 69.4,54.7 U7.42 | R25.2 69.4,56.3 69.4,54.8
!&PROG/*SEEK
  Top 0.305: J12.14 50.13,41.58 65.88,41.58 U7.11
!&RWD_REQ/*FF
  Top 0.305: J12.8 54.1,48.7 56.7,46.1 58.9,46.1 59.3,46.5 R28.1 | 59.3,46.7 R28.1 | R28.1 61.6,47.2 62.5,48.1 U7.3
!&SEEK_REQ
  Top 0.305: J12.16 52.05,41 64.8,41 67.2,38.6 69,38.6 69.4,39 U7.14
!*EJ
  Top 0.305: 65.9,42.4 U7.10 64.81,42.5 64.46,42.15 50.65,42.15 50.35,42.45 J12.13
!*RWD
  Top 0.305: Q4.1 66,49.95 U7.1
!BT_EEPROM  (via drill 0.3, 0.35)
  Top 0.305: v81.4,36.4 81.4,40.5 80.2,41.7 U7.23 | v91.9,47.4 93.1,46.2 93.1,37.4 91.8,36.1 90.2,36.1 89.6,35.5 v89.6,34.5
  Top 0.406: v95.5,23.3 100.5,18.3 U6.P41
  Bottom 0.305: 95.5,28.44 89.6,34.34 v89.6,34.5 89.5,34.5 87.7,36.3 81.5,36.3 v81.4,36.4 | v91.9,47.4 89.6,49.7 J11.P$3
  Bottom 0.406: v95.5,23.3 95.5,28.44
!BT_RST
  Top 0.305: U6.P13 88.5,32.7 87.9,33.3 84.7,33.3 82.3,35.7 82.3,40.7 80.5,42.5 U7.24
!TAPE_EN  (via drill 0.3)
  Top 0.305: Q2.2 58.1,50.6 v58.4,50.3 | v67.8,44.9 71.9,44.9 74.2,42.6 U7.20
  Bottom 0.305: v58.4,50.3 62.1,50.3 67.5,44.9 v67.8,44.9
!TEST  (via drill 0.35)
  Top 0.305: v80.9,49.9 80.9,49.2 79.8,48.1 U7.31
  Bottom 0.305: v80.9,49.9 81.3,49.5 84.2,49.5 J11.P$6
!VOL  (via drill 0.3)
  Top 0.305: 73.7,9.2 73.8,9.1 | U7.21 75,32.7 76.8,30.9 R10.1 76.3,29.5 v75.7,29.5 | v75.7,27 75.7,9.2 75.6,9.1
  Top 0.406: J4.5 83.49,9.1 75.6,9.1 73.8,9.1 70.8,9.1 67.73,6.03 J6.3
  Bottom 0.305: v75.7,29.5 v75.7,27
&FWD
  Top 0.305: J12.11 50.25,44.95 52.48,42.72 64.22,42.72 64.79,43.3 U7.9
&MTL_12V  (via drill 0.3)
  Top 0.305: v61.2,54.1 61.7,54.6 | 61.7,54.6 R26.2 | 61.7,54.6 63.5,54.6 64.6,53.5 66.6,53.5 66.9,53.8 Q1.6
  Bottom 0.305: J12.4 60.8,53.7 v61.2,54.1
&RWD/!*PROG
  Top 0.305: J12.15 46.86,39.95 47.81,38.99 49.4,37.4 50.1,37.4 51.1,38.4 51.1,39.2 52.3,40.4 64.5,40.4 66.9,38 69.4,38 70.2,38.8 U7.15
&SEEK_ACK
  Top 0.305: R33.1 59.3,45.7 60.3,46.7 61.8,46.7 62.4,47.3 U7.4
&SIDE1_5V
  Top 0.305: U7.2 64.3,48.9 R29.1 62.4,50.8 Q4.5
&SIDE1_12V/!*RWD
  Top 0.305: J12.7 54.45,49.95 56.1,48.3 58.7,48.3 59.3,48.9 R34.1 | 59.4,49.4 R34.1 | 60.4,51.3 60.4,50.5 R34.1 | Q2.3 60.4,51.3 | 60.4,51.3 61.2,52.1 62.8,52.1 63.05,51.85 Q4.6
&SIDE2/*ACK
  Top 0.305: R31.2 64.4,54.7 65,54.1 65.6,54.1 66.5,55 Q1.5 67.5,55 67.7,54.8 67.7,52.9 67.9,52.7 68.3,52.7 68.6,52.4 U7.43
&SIDE2_12V/*ACK
  Top 0.305: J12.5 51.85,52.45 R32.2 57.5,58.1 65.4,58.1 65.5,58 65.5,56.5 65.7,56.3 67.85,56.3 Q1.3
*MTL
  Top 0.305: J12.3 52.55,54.95 54.8,57.2 55.8,57.2 58,59.4 68,59.4 70.2,57.2 U7.41
*RWD_EN
  Top 0.305: Q4.2 62.4,53.6 62.7,53.9 63.5,53.9 65.9,51.5 U7.44
*SIDE1
  Top 0.305: J12.2 52.9,56.2 56.6,59.9 68.2,59.9 71,57.1 U7.40
*SIDE2
  Top 0.305: J12.1 53.35,57.45 56.3,60.4 68.4,60.4 71.8,57 U7.39
AGND  (via drill 0.3, 0.35)
  Top 0.152: U3.P$33 72.9,74.7 U3.P$35
  Top 0.2: C15.1 72.5,78 U3.P$29 | C11.2 76.6,71.7 U3.P$17 | U3.P$25 C20.2
  Top 0.305: C15.1 C19.1
  Top 0.406: 47.6,28.8 v44.8,28.8 | 61.2,21.4 R11.1
  Top 0.61: R11.1 59.8,19.8 v59.2,19.8 | v49.8,20.2 J1.3
  Top 1.27: v44.8,63 53.6,63
  Bottom 0.406: v44.8,28.8 42.4,28.8
  Bottom 0.61: v59.2,19.8 56.2,16.8 51.4,16.8 49.8,18.4 v49.8,20.2
  Bottom 1.27: J1.3 44.8,23.2
  Bottom 1.8: 42.4,60.6 v44.8,63
  Bottom 2.54: 44.8,23.2 42.4,25.6 42.4,28.8 42.4,60.6
  other vias: 96.1,79 96.1,82 96.1,84.5 96.1,87 92.9,84.5 64.6,89.8 68.6,89.8 72.6,89.8 76.1,89.8 76.1,87.8 72.6,87.8 78.3,70 86.1,87.8 87.1,89.8 96.1,89.8 80.9,70 82.9,71.5 91.5,82 92.1,76 92.1,73 89.1,73 89.1,76 96.1,76 94.1,73 92.1,70 89.1,70 78.6,83.5 76.6,83.5 76.6,81 78.6,81 77.6,82 59.1,66 62.1,66 56.1,66 49.5,68.4 50.1,73 54.1,73 54.1,78 50.1,80 50.1,85 50.1,90 55.1,90 60.1,90 55.1,85 65.1,86 50.1,63 58.6,80 75.6,72.8 65.1,66 91,79 62.2,82 59.1,69 62.1,69 65.1,69 59.1,63 62.1,63 65.1,63 68.1,66 68.1,69 56.1,63 56.1,69 53.1,66 53.1,63
  pour Top (isolate 0.3, rank 5): 48.9,91.4 48.9,62.3 69.1,62.3 69.1,69.4 92.8,69.4 96.6,74 96.6,91.4
  pour Bottom (isolate 0.3, rank 5): 48.9,91.4 48.9,62.3 69.1,62.3 69.1,69.4 92.8,69.4 96.6,74.1 96.6,91.4
AOUTL  (via drill 0.35)
  Top 0.305: R17.2 82.3,80.8 R16.1 C32.1 83.5,82.5 v81.8,82.5 | J9.3 87.3,86.48 v87.3,86.2
  Bottom 0.305: v81.8,82.5 83.6,82.5 v87.3,86.2
AOUTLB  (via drill 0.3)
  Top 0.305: R20.1 82.2,84.2 C32.2 84.5,85.1 J10.1
  Top 0.406: v81.4,86.3 81.9,85.8 R20.1
  Bottom 0.406: J8.P$3 78.1,86.1 81.2,86.1 v81.4,86.3
AOUTR
  Top 0.305: C33.1 R18.1 87,80.8 R19.2 88.7,82.5 89.6,82.5 91.77,84.67 J9.2
AOUTRB  (via drill 0.35)
  Top 0.305: R21.1 87.2,84.2 C33.2 v85.6,86.2
  Bottom 0.305: v85.6,86.2 85.25,86.2 J10.2
  Bottom 0.406: J8.P$1 80.55,87 J10.2
AUX_SELECT  (via drill 0.35)
  Top 0.305: U6.P36 94.5,18.9 92.1,21.3 89.2,21.3 v85.9,24.6 | v81.9,31.6 77.1,36.4 77.1,40.4 75.9,41.6 75.9,43 76.2,43.3 U7.25
  Bottom 0.305: v85.9,24.6 81.9,28.6 v81.9,31.6
AUXINL
  Top 0.406: 66.1,72.2 66.2,72.1 C6.1 64.9,72.2 R6.1 R7.2
AUXINLPS
  Top 0.406: J1.5 44.6,27.2 43.4,28.4 43.4,63.4 44.6,64.6 49.7,64.6 59.1,74 R6.2
AUXINR
  Top 0.406: R5.2 R4.1 64.9,74 C4.1
AUXINRPS
  Top 0.406: J1.4 43.8,25.2 42.6,26.4 42.6,63.6 44.3,65.3 49.4,65.3 59.9,75.8 R4.2
BCLK  (via drill 0.3)
  Top 0.2: 78.5,60.3 78.5,62.3 73.3,67.5 U3.P$14
  Top 0.305: 78.5,60.3 82,56.8 88.6,56.8 95.1,50.3 95.1,40.6 96.5,39.2 v96.8,39.2 | v96.8,36.1 96.8,36 100.5,32.3 U6.P3
  Bottom 0.305: v96.8,39.2 v96.8,36.1
CODEC_EN  (via drill 0.3, 0.35)
  Top 0.2: 70.5,72.6 70.5,73.4 U3.P$8
  Top 0.305: v75.2,59.6 75.3,59.5 R3.1 75.3,54.7 v74.9,54.3 | 70.5,65.1 v70.7,65.1 70.5,65.3 70.5,72.6 | U7.38 72.6,53.3 v72.7,53.4
  Bottom 0.305: v75.2,59.6 72.9,59.6 70.7,61.8 v70.7,65.1 | v72.7,53.4 73.6,54.3 v74.9,54.3
DAC_OUTL
  Top 0.305: C28.2 R16.2
DAC_OUTR
  Top 0.305: C29.2 R18.2
DACL
  Top 0.2: U3.P$20 82.6,74.7 C28.1
DACR
  Top 0.2: C29.1 84.2,74.3 U3.P$19
DFU  (via drill 0.3, 0.35)
  Top 0.305: U6.P32 89.7,18.5 v89.2,19 | 92,46.2 v91.9,46.3 92.6,45.6 92.6,37.7 91.6,36.7 89.9,36.7 88.8,35.6 v88.8,33.9
  Bottom 0.305: v89.2,19 88.8,19.4 v88.8,33.9 | v91.9,46.3 90.5,47.7 J11.P$5
GND  (via drill 0.3, 0.35)
  Top 0.2: C5.2 73.7,71.6 U3.P$15
  Top 0.305: C5.2 C1.2 | C13.2 C16.2 80.5,77.5 v81.6,76.4
  Top 0.406: U7.6 67.9,45.7 67.9,45.8 | 80.6,46.9 79,46.9 78.6,46.5 U7.29 68.3,46.5 v67.8,46 | v86.9,72.4 88.2,71.1 v88.2,68.2 | C36.2 82.7,47.5
  Top 1.27: U1.1 70.26,25.89 C7.2
  Bottom 0.406: v81.6,76.4 85.6,72.4 v86.9,72.4
  other vias: 72.5,7.9 71,4.1 70.8,46.5 63.6,2.5 101.4,19.6 83.2,62.6 45,59.4 86.2,60.2 49.5,59.4 76,67.1 78.2,64.8 87.3,28.6 95,33.1 94.7,35.4 85.2,59.2 60.6,48.1 56.3,47.5 65.6,55.4 84.9,50.4 68.6,53.4 76,54.1 62.1,45.3 50.2,9 48,9 43.4,16.6 43.4,20.8 56.7,61.4 65.9,61.4 87.5,58 77.1,55.6 68.4,49.1 68.4,42.3 79.2,39.9 81.6,34.3 44.6,33.9 49.2,2.4 55.7,50.8 76.8,25.8 87.2,32.5 70.8,25 70.6,33.4 62.8,12.6 64.8,14.6 41.2,65.4 73,11 73,15 73,19 77,11 77,15 77,19 81,15 81,11 89,11 89,7 89,3 93,3 97,3 101,3 101,7 97,7 93,7 97,11 101,11 77.2,32.9 83.4,47.8 83.7,39.9
  pour Bottom (isolate 0.254, rank 6): -0.1,91.4 115.1,91.4 115.1,0 -0.1,0
  pour Top (isolate 0.254, rank 6): -0.1,0 115.1,0 115.1,15.7 105.7,15.7 105.7,31.9 115.1,31.9 115.1,91.4 -0.1,91.4
I2SDATA_AUX  (via drill 0.3)
  Top 0.2: 77.3,59.9 77.3,62.3 72.5,67.1 U3.P$12
  Top 0.305: U6.P1 102.82,30.93 102.82,33.18 v100.7,35.3 | 77.3,59.9 81.4,55.8 88,55.8 94.1,49.7 94.1,40 98.3,35.8 v98.3,35.6
  Bottom 0.305: v98.3,35.6 100.4,35.6 v100.7,35.3
I2SDATA_SPK
  Top 0.2: 76.7,59.7 76.7,62.3 72.1,66.9 U3.P$11
  Top 0.305: 76.7,59.7 81.1,55.3 87.7,55.3 93.6,49.4 93.6,38.1 99.3,32.4 U6.P4
ICSPCLK  (via drill 0.35)
  Top 0.305: U7.16 71,42.8 v71.9,43.7
  Bottom 0.305: v71.9,43.7 73.1,43.7 74.6,45.2 84,45.2 84.5,45.7 J11.P$8
ICSPDAT  (via drill 0.35)
  Top 0.305: U7.17 71.8,42.5 v72,42.7
  Bottom 0.305: v72,42.7 72.8,42.7 74.8,44.7 85,44.7 J11.P$10
LRCLK
  Top 0.2: 77.9,60.1 77.9,62.3 72.9,67.3 U3.P$13
  Top 0.305: 77.9,60.1 81.7,56.3 88.3,56.3 94.6,50 94.6,40.3 101.7,33.2 U6.P2
MCLR  (via drill 0.35)
  Top 0.305: v72.7,41.8 72.6,41.7 U7.18 R24.1
  Bottom 0.305: v72.7,41.8 75.1,44.2 83.5,44.2 J11.P$12
MCU_RX  (via drill 0.3, 0.35)
  Top 0.305: U6.P20 84.1,26.1 v85.3,27.3 | v86.4,34.2 89.8,37.6 89.8,42 v89.1,42.7 89.1,43.4 89.8,44.1 v89.8,52 | U7.32 78.6,48.9 83,53.3 87.8,53.3 v87.9,53.2
  Bottom 0.305: v85.3,27.3 85.3,33.1 v86.4,34.2 | v89.1,42.7 88.1,43.7 J11.P$9 | v87.9,53.2 88.6,53.2 v89.8,52
MCU_TX  (via drill 0.3, 0.35)
  Top 0.305: 79.9,51.7 R22.2 R23.1 v86.9,54.1 | U6.P19 83.7,27.3 v84.5,28.1 | v85.2,34 89.1,37.9 v89.1,40.6 | 90.2,43.2 v90.2,43.1 90.7,43.6 v90.7,50.8
  Bottom 0.305: v84.5,28.1 84.5,33.3 v85.2,34 | v90.2,43.1 90.2,41.7 v89.1,40.6 J11.P$11 | v86.9,54.1 89,54.1 90.7,52.4 v90.7,50.8
MCU_TX_5V
  Top 0.305: R22.1 78.1,52.2 77.1,53.2 75.4,53.2 75,52.8 U7.35
MIC_IN
  Top 0.2: U3.P$2 69.8,75.9 C27.1
MICGND
  Top 0.61: J1.1 47.6,18.4 54,18.4 R11.2
MICOUT  (via drill 0.3)
  Top 0.406: J1.2 41.8,26.2 41.8,63.8 44,66 49,66 57.8,74.8 v57.8,75.1 | v64.4,75.9 64.5,75.8 R8.2 C27.2
  Bottom 0.406: 46.9,21.2 J1.2 | v57.8,75.1 58.6,75.9 v64.4,75.9
MICPWR
  Top 0.2: U3.P$4 68.8,75.1 R8.1
N$1
  Top 0.305: J12.9 50.55,47.45 53.1,44.9 R33.2
N$2
  Top 0.305: 59.35,55.95 R30.2 59.4,55.9 59.4,52.1 | 59.4,52.1 60.4,52.1 61.2,52.9 Q4.3 | 59.4,52.1 58.5,52.1 58.1,52.5 Q2.5
N$12
  Top 0.2: C14.2 73.7,78 U3.P$26
N$14
  Top 0.2: C10.2 69.8,77.7 71.5,77.7 71.7,77.5 U3.P$31
N$15
  Top 0.2: C20.1 77.3,78.4 76.1,78.4 74.8,77.1 U3.P$24
N$16
  Top 0.406: J6.1 67.09,2.01 67.09,2.07 J5.8
N$17
  Top 0.2: U3.P$30 72.1,77.7 71.6,78.2 70,78.2 69.2,79 69.2,80.2 68.2,81.2 C12.2
N$18
  Top 0.2: U3.P$27 73.3,78.2 73.8,78.7 73.8,80.3 74.4,80.9 C14.1
N$19
  Top 0.2: U3.P$7 69.8,73.9 C6.2
N$20
  Bottom 1.016: J6.2 61.1,4.01 J5.7
N$21
  Top 0.406: J5.5 58.44,7.4 67.12,7.4 J6.4
N$22
  Top 0.406: 67.71,10.01 J6.5 67.61,10.01 65.6,8 57.04,8 J5.4
N$23
  Top 0.406: J5.3 55.64,8.6 65.1,8.6 66.3,9.8 66.3,10.6 67.71,12.01 J6.6
N$24
  Top 0.406: J5.2 54.34,9.3 64.8,9.3 65.7,10.2 65.7,12 67.71,14.01 J6.7
N$25
  Top 0.406: J5.1 53.04,10 64.5,10 65,10.5 65,12.3 66.3,13.6 66.3,14.6 67.71,16.01 J6.8
N$26
  Top 0.2: U3.P$6 68.4,74.3 C4.2
N$32
  Top 0.406: J3.5 83.49,2.04 J4.1
N$33
  Bottom 1.016: J4.2 77.47,4.04 J3.4
N$49
  Bottom 1.016: J3.3 75.47,7.9 82,7.9 82,6.04 J4.3
N$50
  Top 0.406: J4.4 84.17,8.3 75.7,8.3 J3.2
PWR_1V8  (via drill 0.35)
  Top 0.2: U3.P$21 76.4,75.1 C13.1
  Top 0.305: C13.1 C16.1 v80.7,75.7 | U5.5 84.25,68.35 C31.1 84.3,72.4 v83.9,72.8
  Bottom 0.305: v83.9,72.8 83.9,73.2 81.4,75.7 v80.7,75.7
PWR_1V8_EN  (via drill 0.35)
  Top 0.305: U5.3 86.4,63.7 87.3,62.8 87.3,59.8 85.7,58.2 82.2,58.2 v81.5,58.9 81.6,59 | v76.9,51.9 76.9,50.8 75.9,49.8 75.9,47.8 76.4,47.3 U7.30
  Bottom 0.305: v81.5,58.9 76.9,54.3 v76.9,51.9
PWR_3V3  (via drill 0.3, 0.35)
  Top 0.2: C5.1 74.3,72.8 U3.P$16
  Top 0.305: C5.1 C1.1 80.2,68.6 C8.1 | C8.1 80.4,66.35 U2.5 79.3,65.25 v79.3,60.7 | v76.5,58.6 77.1,58 R3.2 78.4,57.2 80.8,54.8 87.4,54.8 89.1,53.1 v89.1,46.7 | 79.9,68.4 C8.1
  Bottom 0.305: v79.3,60.7 77.2,58.6 v76.5,58.6 | v89.1,46.7 88.1,45.7 J11.P$7
PWR_5V  (via drill 0.3, 0.35)
  Top 0.305: 63.35,84.8 U4.1 64.35,84.85 64.7,84.5 64.7,83.4 64.25,82.95 U4.3 | C2.1 80.3,63.65 U2.1 80.35,64.75 80.6,65 82,65 82.25,64.75 U2.3 | U5.1 84.25,61.65 C23.1 | v66,58.6 66.6,58 R25.1 | 64,57.2 R31.1 63.6,57.2 v62.9,56.5 | v72.6,55.7 72.6,58.1 R1.2 R2.2 | R24.2 70.3,36.2 70.1,36.4
  Top 0.406: v80.3,59.9 C2.1 | v83.8,60.2 84.3,60.7 C23.1 | U7.28 C36.1 81.2,44 v83.3,41.9 | U7.7 64.75,44.9 C35.1 v63.8,45.1 | v82.5,46 82.2,45.7 81.3,45.7 | U4.1 61.75,84.85 C21.1
  Top 0.61: 81.3,45.7 C36.1 | C37.1 U6.P23
  Top 0.813: v46.5,38.3 46.5,35.6 47.4,34.7 C9.1 | U1.2 C7.1 73.6,28.2 | 73.6,28.2 R10.2 78.3,26.7 78.3,23.7 C37.1 | 73.6,28.2 73.6,32 70.1,35.5 70.1,36.4 v70.1,36.6 | v55.8,82.9 56.9,84 C21.1
  Bottom 0.305: 71,55.7 68.9,55.7 v66,58.6 63.9,56.5 v62.9,56.5
  Bottom 0.406: v83.8,60.2 83.5,59.9 v80.3,59.9 76.1,55.7 v72.6,55.7 | 71,55.7 v72.6,55.7 | v72.6,55.7 72.6,54.6 71.9,53.9 71.9,46 | v83.3,41.9 85.5,39.7 J11.P$14 | 70.1,44 65.1,44 v63.8,45.1 | v82.5,46 72.1,46 71.9,45.8
  Bottom 0.61: 70.1,44 71.9,45.8 71.9,46
  Bottom 0.813: v55.8,82.9 46.5,73.6 v46.5,38.3 | v70.1,36.6 70.1,44
  other vias: 50.5,30 68,24 65.5,24 65.7,27.1 65.7,29.1 65.5,33 68,33 63.7,29.1 63.7,27.1 63.7,28.1 62.5,24 59.5,24 59.7,26.6 59.7,29.6 59.5,33 62.5,33 56.5,24 56.5,27 56.5,30 56.5,33 56.5,36 59.5,36 62.5,36 65.5,36 68,36 53.5,36 53.5,33 50.5,33 53.5,30 53.5,27 50.5,27 53.5,24 50.5,24 50.5,21 53.5,21 61.7,31 61.7,25.5 65.7,28.1 65.5,21.5 63,21.5 56.5,38.5 59.5,38.5 62.5,38.5 63.7,26.1 65.7,26.1 64.7,26.1 64.7,27.1 64.7,28.1 64.7,29.1 64.7,30.1 63.7,30.1 65.7,30.1
  pour Bottom (isolate 0.254, rank 4): 69.2,35.4 69.2,21.2 68,20 65.6,20 61.6,16 51,16 49.3,17.7 49.3,33.3 55.8,39.8 64.8,39.8
  pour Top (rank 4): 69.7,36.5 69.7,21.7 64.2,16.1 49.6,16.1 46.9,18.8 46.9,33.8 52.7,39.6 66.5,39.6
  pour Top (no thermals): 60,25.6 63.6,25.6 63.6,30.8 60,30.8
  pour Top (no thermals): 67.6,29.4 65.6,29.4 65.6,27 69.4,27 69.4,29.4
PWR_12V  (via drill 0.3, 0.35)
  Top 0.305: 57.5,53.9 R30.1 58.7,57.2 R26.1 | R32.1 56.1,53.9 57.5,53.9 | 57.5,53.9 58.5,53.9 58.75,53.65 Q2.4
  Top 0.406: v51.4,51.4 52.6,51.4 R32.1 | v52,39 52.7,39.7 64.3,39.7 66.6,37.4 68.7,37.4 69.2,36.9 69.2,30.45 | R27.1 57.3,11.2 58,11.9 58,12.8 60.09,14.89 Q3.1 62.99,14.89 64,15.9 64,17.1 63.66,17.43 Q3.3 63.13,17.43 v63.85,18.15
  Top 0.813: 66.81,30.51 U1.3 67.86,30.45 69.2,30.45 C3.1 71.25,30.45 v72.2,29.5
  Bottom 0.406: 51.9,39 v52,39 51.4,39.6 v51.4,51.4
  Bottom 0.813: J11.P$13 88,39.1 86.8,37.9 76.5,37.9 72.2,33.6 v72.2,29.5 72.2,24.1 68.1,20 65.7,20 v63.85,18.15 60.2,14.5 45.61,14.5 J2.1
PWR_A3V3  (via drill 0.35)
  Top 0.2: U3.P$18 76.6,73.9 C11.1 | U3.P$28 C15.2
  Top 0.305: 73.05,79.85 C15.2 C19.2 | 73.03,81.37 C19.2 | C30.1 66.05,84.8 U4.5 | v80.4,82.5 80.1,82.8 R20.2 79.2,84.8 76.5,84.8 C19.2 | R21.2 89.3,85.4 v88.5,86.2
  Top 0.406: C11.1 C17.1 81.2,73.5 v81.7,73 | 68.8,84.8 C30.1 69.61,84.8 v71.6,82.8 73.03,81.37
  Bottom 0.305: v80.4,82.5 81.2,81.7 84,81.7 v88.5,86.2
  Bottom 0.406: v81.7,73 78.2,73 71.6,79.6 v71.6,82.8
SCL  (via drill 0.3, 0.35)
  Top 0.2: 73.65,63.55 71.3,65.9 U3.P$9
  Top 0.305: R1.1 73.65,58.6 | 73.65,63.55 73.65,58.6 | 73.65,58.6 73.65,53.05 73.4,52.8 U7.37 73.4,49.1 v74.4,48.1 | v82.1,50.9 83.6,52.4 v83.6,52.6
  Bottom 0.305: 74.4,48.3 v74.4,48.1 76,49.7 78.5,49.7 79.7,50.9 v82.1,50.9 | v83.6,52.6 83.9,52.9 87,52.9 88,51.9 J11.P$1
SDA  (via drill 0.35)
  Top 0.2: 74.15,63.55 74.15,63.65 71.7,66.1 U3.P$10
  Top 0.305: v75.2,61 74.15,61 | 74.15,63.55 74.15,61 | 74.15,61 74.15,51.55 U7.36 74.3,51.4 v74.3,49.4 | R2.1 71.8,62.5 v71.8,62.6
  Bottom 0.305: v75.2,61 73.4,61 v71.8,62.6 | v74.3,49.4 75.1,50.2 78.2,50.2 79.6,51.6 85.9,51.6 J11.P$2
TAPEIN
  Top 0.406: R12.1 48.91,15.8 49.01,15.89
  Top 0.61: Q3.5 Q3.6 50.55,17.43 49.01,15.89 J2.2
TAPEINSIG  (via drill 0.3)
  Top 0.305: Q2.6 55.2,52.9 v53,50.7
  Top 0.406: Q3.2 v60.27,16.16 57.1,13 R27.2
  Bottom 0.305: v53,50.7 53,37.7 49.1,33.8 49.1,18.1 51.03,16.16 v60.27,16.16
TAPEOUT
  Top 0.305: R9.1 54.8,14.89
  Top 0.406: J2.3 46.7,3.9 J13.1
  Top 0.61: Q3.7 Q3.8 54.8,14.89 50.01,14.89 J2.3 | 61.3,18.7 Q3.4 60.01,18.7 58.9,17.6 58.9,17 58.06,16.16 Q3.7 | 56.92,16.2 Q3.7

### Text on the board
tDocu: 5905/7 | 5908 | rev 9 | MDeck BA-2 / BMW CM5905/7/8 BT Retrofit | 5905/7 Align Left | MIC+AUX | POWER | 5908 | 5905/7